# EAGLE schematic microcontroller (EAGLE 6.6.0)
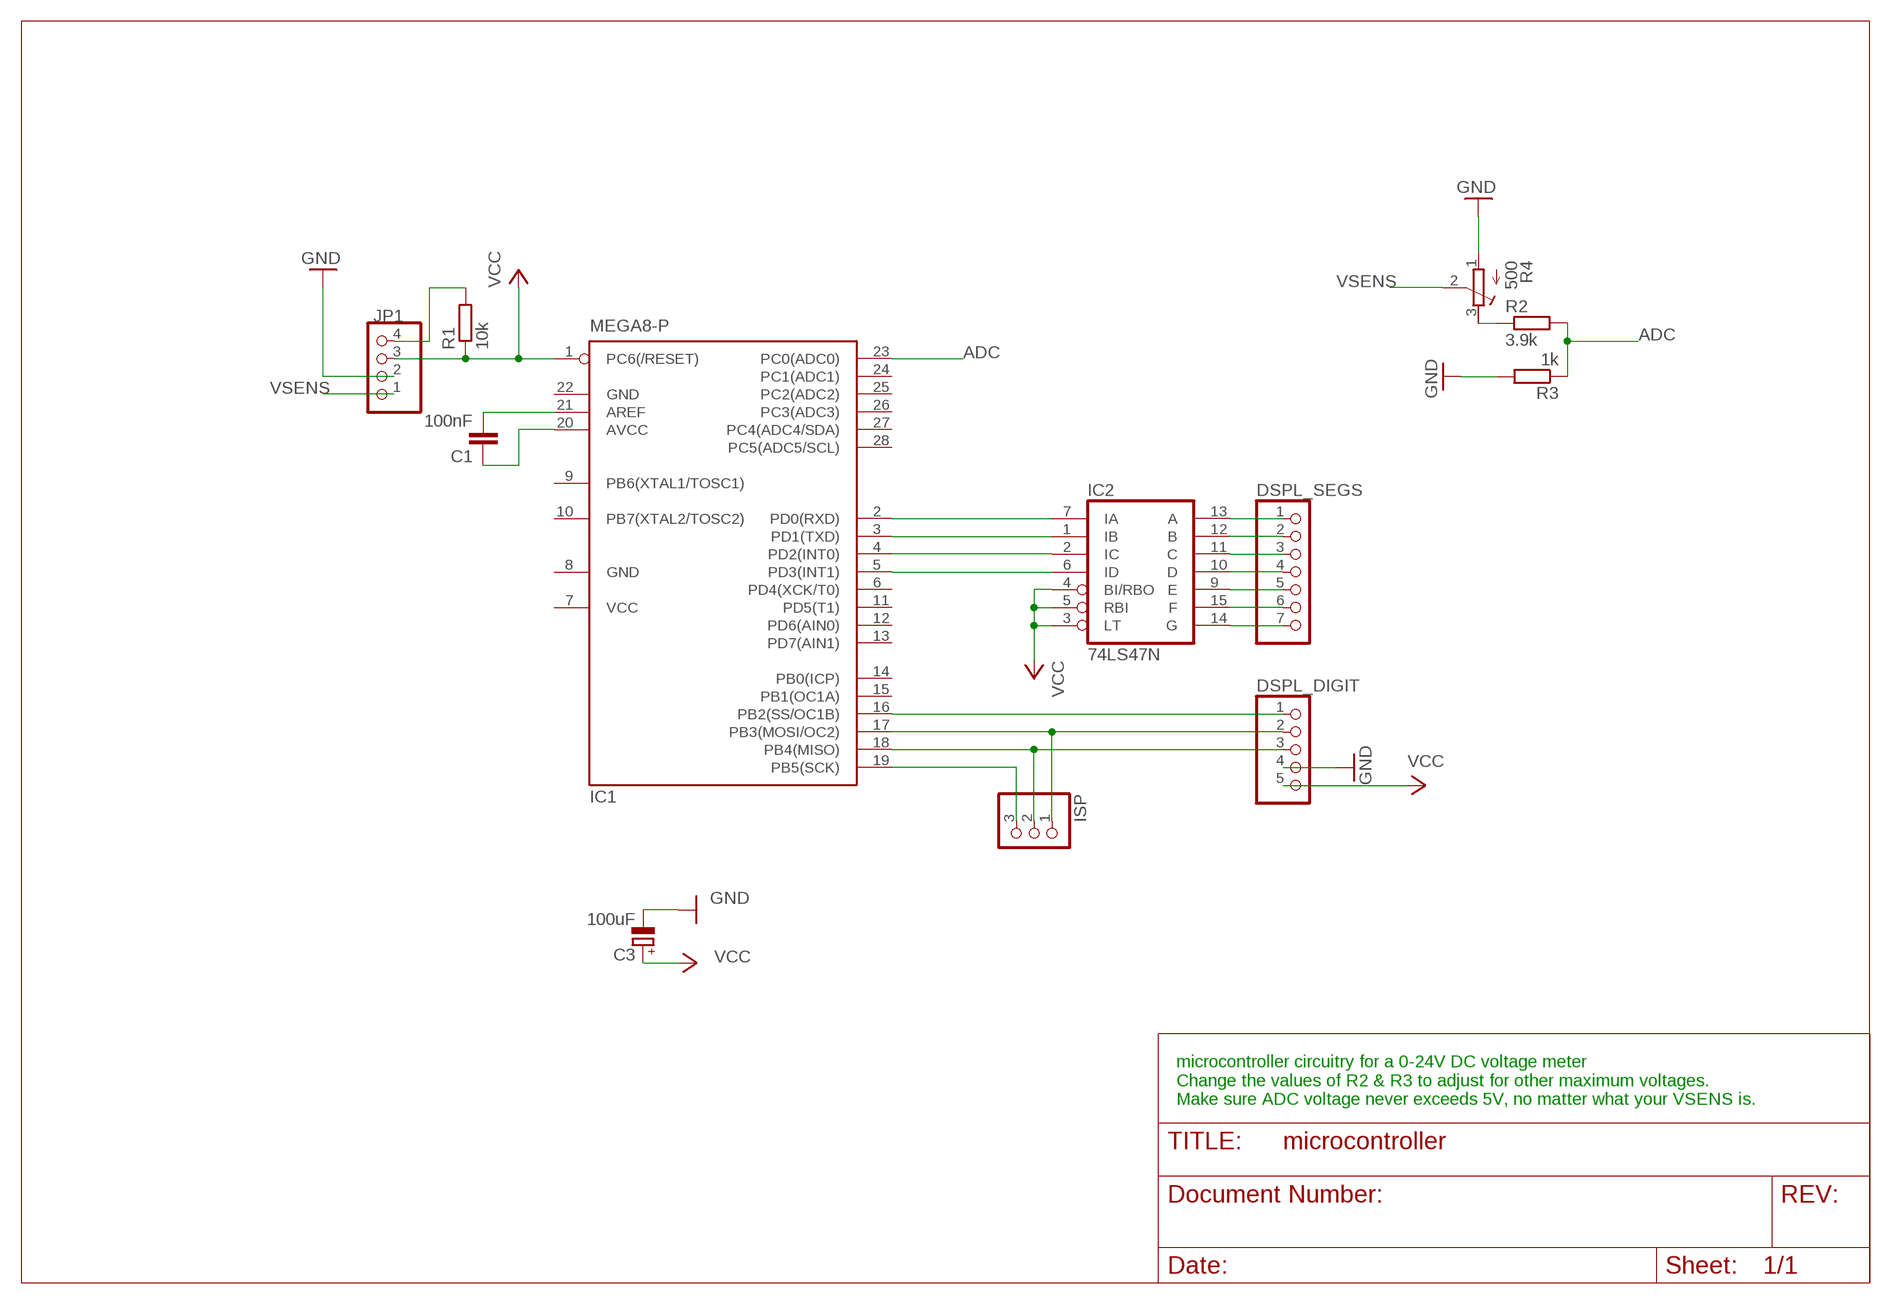
[diagram p0: schematic, sheet 1]

## Parts
C1  100nF  C-EU025-024X044  [C025-024X044]
C3  100uF  CPOL-EUE1.8-4  [E1,8-4]
DSPL_DIGIT  PINHD-1X5  [1X05]
DSPL_SEGS  PINHD-1X7  [1X07]
IC1  MEGA8-P  [DIL28-3]
IC2  74LS47N  [DIL16]
ISP  PINHD-1X3  [1X03]
JP1  PINHD-1X4/90  [1X04/90]
R1  10k  R-EU_0207/2V  [0207/2V]
R2  3.9k  R-EU_0207/2V  [0207/2V]
R3  1k  R-EU_0207/2V  [0207/2V]
R4  500  R-TRIMM64X  [RTRIM64X]

## Nets
ADC: IC1.23(PC0(ADC0)) R2.2 R3.1
GND: C3.- DSPL_DIGIT.4 JP1.2 R3.2 R4.1(A)
N$1: JP1.4 R1.2
N$2: R2.1 R4.3(E)
N$3: DSPL_SEGS.7 IC2.14(G)
N$4: DSPL_SEGS.6 IC2.15(F)
N$5: DSPL_SEGS.5 IC2.9(E)
N$6: DSPL_SEGS.4 IC2.10(D)
N$7: DSPL_SEGS.3 IC2.11(C)
N$8: DSPL_SEGS.2 IC2.12(B)
N$9: DSPL_SEGS.1 IC2.13(A)
N$10: DSPL_DIGIT.1 IC1.16(PB2(SS/OC1B))
N$11: IC1.2(PD0(RXD)) IC2.7(IA)
N$12: IC1.3(PD1(TXD)) IC2.1(IB)
N$13: IC1.4(PD2(INT0)) IC2.2(IC)
N$14: IC1.5(PD3(INT1)) IC2.6(ID)
N$15: DSPL_DIGIT.2 IC1.17(PB3(MOSI/OC2)) ISP.1
N$16: DSPL_DIGIT.3 IC1.18(PB4(MISO)) ISP.2
N$17: IC1.19(PB5(SCK)) ISP.3
N$18: C1.2 IC1.21(AREF)
N$19: C1.1 IC1.20(AVCC)
VCC: C3.+ DSPL_DIGIT.5 IC1.1(PC6(/RESET)) IC2.3(LT) IC2.4(BI/RBO) IC2.5(RBI) JP1.3 R1.1
VSENS: JP1.1 R4.2(S)
Unconnected: IC1.6(PD4(XCK/T0)) IC1.9(PB6(XTAL1/TOSC1)) IC1.10(PB7(XTAL2/TOSC2)) IC1.11(PD5(T1)) IC1.12(PD6(AIN0)) IC1.13(PD7(AIN1)) IC1.14(PB0(ICP)) IC1.15(PB1(OC1A)) IC1.24(PC1(ADC1)) IC1.25(PC2(ADC2)) IC1.26(PC3(ADC3)) IC1.27(PC4(ADC4/SDA)) IC1.28(PC5(ADC5/SCL))

## Notes on the sheet
- microcontroller circuitry for a 0-24V DC voltage meter
  Change the values of R2 & R3 to adjust for other maximum voltages. 
  Make sure ADC voltage never exceeds 5V, no matter what your VSENS is.

## Power pins joined to a net without a drawn wire
GND: IC1.8(GND) IC1.22(GND) IC2.8(GND)
VCC: IC1.7(VCC) IC2.16(VCC)

## Library data of the parts
C1 = rcl:C-EU: CAPACITOR, European symbol
C3 = rcl:CPOL-EU: POLARIZED CAPACITOR, European symbol
DSPL_DIGIT = pinhead:PINHD-1X5: PIN HEADER
DSPL_SEGS = pinhead:PINHD-1X7: PIN HEADER
IC1 = atmel:MEGA8-P: MICROCONTROLLER 8 Kbytes FLASH, 1 kbytes SRAM, 512 bytes EEPROM, USART, 4-channel 10 bit ADC, 2-channel 8 bit ADC Pin compatible with Atmega48, ATMega88, ATMega168 Source: avr.lbr; OC_FARNELL: unknown; OC_NEWARK: unknown
IC2 = 74xx-eu:74*47: BCD to seven segment DECODER/DRIVER Source: http://www.ee.washington.edu/stores/DataSheets/74ls/74ls47.pdf
ISP = pinhead:PINHD-1X3: PIN HEADER
JP1 = pinhead:PINHD-1X4: PIN HEADER
R1-R3 = rcl:R-EU_: RESISTOR, European symbol
R4 = rcl:R-TRIMM: Trimm resistor